# Altium schematic sheet STALO_2.SchDoc: STALO_2 (part 2 of 2)
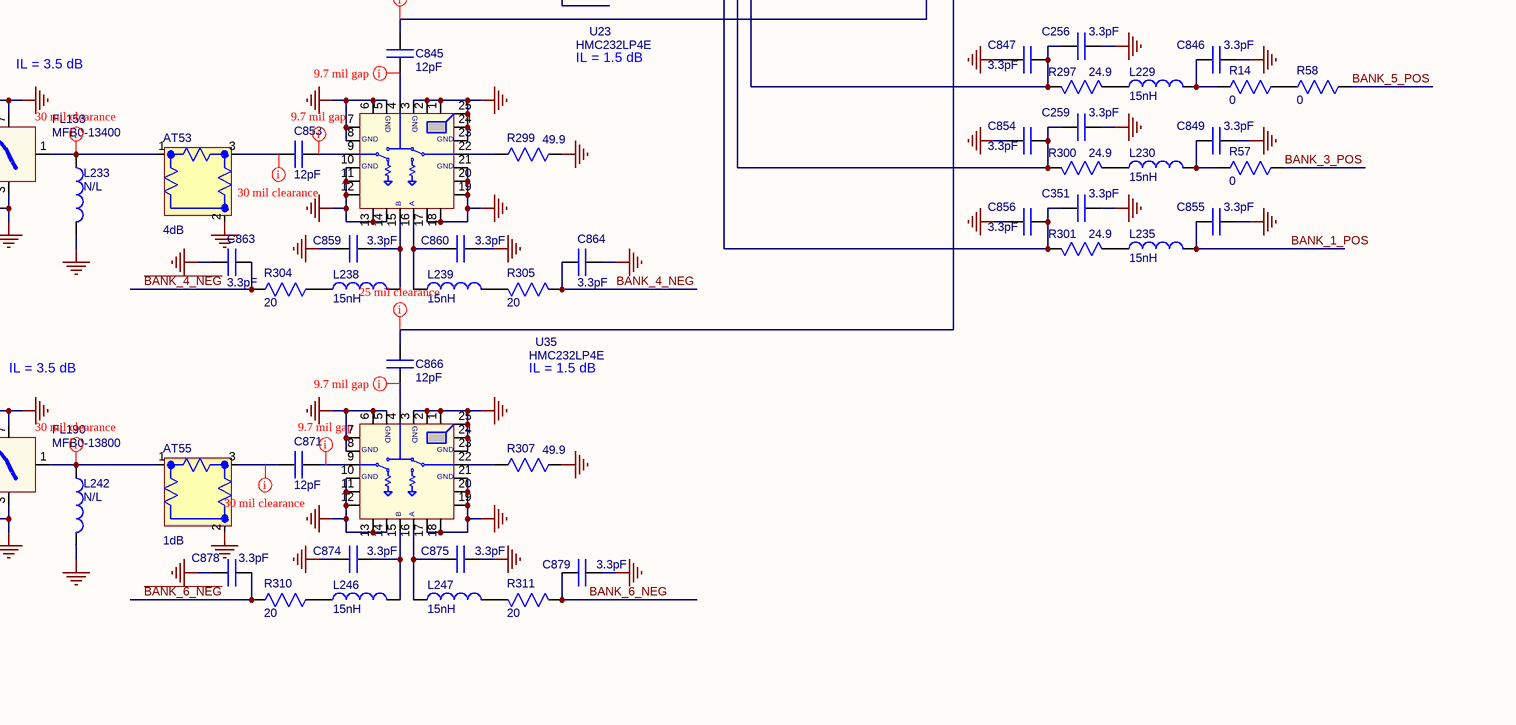
[diagram p4: STALO_2.SchDoc, bottom right]

## Library data of the parts
AT2 AT5 AT9 AT11 AT15 AT54 AT59 AT62 = MPFC-A1002: NoLoad: .; Approved: CL; M_PN: IMS1141-02DB; MFGR: IMS RESISTORS; level: 1; line_number: 10; ModifyDate: 3/8/13; G_PN: MPFC-A1002; item_number: MPFC-A1002
AT4 AT7 AT8 AT13 AT53 AT57 = MPFC-A1004: NoLoad: .; Approved: CL; M_PN: IMS1141-04DB; MFGR: IMS RESISTORS; level: 1; line_number: 30; ModifyDate: 3/8/13; G_PN: MPFC-A1004; item_number: MPFC-A1004
AT55 = MPFC-A1001: NoLoad: .; Approved: CL; M_PN: IMS1141-01DB; MFGR: IMS RESISTORS; level: 1; line_number: 15; ModifyDate: 3/8/13; G_PN: MPFC-A1001; item_number: MPFC-A1001
AT61 = MPFC-A1000: NoLoad: .; Approved: CL; M_PN: IMS1141-00DB; MFGR: IMS RESISTORS; level: 1; line_number: 50; ModifyDate: 4/16/13; G_PN: MPFC-A1000; item_number: MPFC-A1000
C18 C20 C25 C29 C111 C113 C114 C116 C188 C200 C201 C203 C401 C722 C822 C828 C829 C831 C845 C850 C851 C853 C866 C868 C869 C871 C881 = CK40-00120: Approved: CL; NoLoad: .; MFGR: ANY; level: 1; line_number: 165; G_PN: CK40-00120; ModifyDate: 10/06/12; M_PN: ANY; item_number: CK40-00120
C102-C105 C108 C109 C117 C118 C148-C152 C175-C179 C182-C186 C191-C193 C195-C199 C232-C234 C241 C253-C256 C259 C351-C357 C365-C367 C399 C400 C826 C827 C832-C839 C842 C843 C846 C847 C849 C854-C864 C872-C879 = CK35-00033: MFGR: VENKEL; M_PN: C0201C0G500-3R3BNP; Approved: CL; NoLoad: .; level: 1; line_number: 155; ModifyDate: 6/24/13; G_PN: CK35-00033; item_number: CK35-00033
C106 C107 C115 C180 C181 C840 C841 C886 C891 C893 C953-C955 C965-C967 = CK41-00024: MFGR: ATC; M_PN: 600L2R4AT200; Approved: CL; NoLoad: .; level: 1; line_number: 60; ModifyDate: 02/09/13; G_PN: CK41-00024; item_number: CK41-00024
C189 C190 C823 C825 C892 = CK40-04100: Approved: CL; MFGR: VENKEL; M_PN: C0402X7R160-104KNP; NoLoad: .; level: 1; line_number: 95; ModifyDate: 3/29/13; G_PN: CK40-04100; item_number: CK40-04100
C361 C961 C1224 = CK45-04100: Approved: CL; NoLoad: .; MFGR: ANY; level: 1; line_number: 105; ModifyDate: 02/22/12; G_PN: CK45-04100; M_PN: ANY; item_number: CK45-04100
C402 C956-C958 C968 = TCC3-03100: Approved: CL; NoLoad: .; MFGR: ATC; M_PN: ATC520L103KT16T; level: 1; line_number: 90; G_PN: TCC3-03100; ModifyDate: 4/26/13; item_number: TCC3-03100
C727 C730 C952 C962-C964 = CK40-00120: MFGR: ANY; Approved: CL; NoLoad: .; level: 1; line_number: 165; ModifyDate: 10/06/12; M_PN: ANY; G_PN: CK40-00120; item_number: CK40-00120
C880 C883 C885 = CK40-00330: Approved: CL; MFGR: ANY; NoLoad: .; level: 1; line_number: 295; ModifyDate: 3/9/13; G_PN: CK40-00330; M_PN: ANY; item_number: CK40-00330
C882 = CK41-00018: Approved: CL; NoLoad: .; M_PN: 600L1R8AT200; MFGR: ATC; level: 1; line_number: 175; G_PN: CK41-00018; ModifyDate: 02/09/13; item_number: CK41-00018
C884 = CK41-00007: Approved: CL; NoLoad: .; M_PN: 600L0R7AT200; MFGR: ATC; level: 1; line_number: 300; G_PN: CK41-00007; ModifyDate: 4/9/13; item_number: CK41-00007
C887-C890 = CK40-01100: MFGR: Any; Approved: CL; NoLoad: .; level: 1; line_number: 70; ModifyDate: 3/21/12; M_PN: Any; G_PN: CK40-01100; item_number: CK40-01100
C959 = CK40-00120: Approved: CL; MFGR: ANY; level: 1; line_number: 165; G_PN: CK40-00120; ModifyDate: 10/06/12; M_PN: ANY; item_number: CK40-00120
C969 C970 C1225-C1229 = CK40-01470: Approved: CL; MFGR: Any; NoLoad: .; level: 1; line_number: 75; ModifyDate: 02/22/12; G_PN: CK40-01470; M_PN: Any; item_number: CK40-01470
FL11 FL22 FL23 FL45 FL49 FL50 = LFS0-00222: Approved: CL; NoLoad: .; M_PN: NFE31PT222Z1E9BL; MFGR: MURATA; level: 1; line_number: 335; G_PN: LFS0-00222; ModifyDate: 02/22/12; Value: 2200pF; item_number: LFS0-00222
FL27 FL28 = MFB0-13600: Approved: CL; NoLoad: .; Value: 940685; MFGR: IMC; level: 1; line_number: 385; ModifyDate: 5/30/13; M_PN: 940685; G_PN: MFB0-13600; item_number: MFB0-13600
FL29 FL33 = MFB0-13200: Approved: CL; MFGR: IMC; NoLoad: .; Value: 940683; level: 1; line_number: 410; ModifyDate: 5/30/13; M_PN: 940683; G_PN: MFB0-13200; item_number: MFB0-13200
FL34 FL37 = MFB0-12800: Approved: CL; MFGR: IMC; NoLoad: .; Value: 940681; level: 1; line_number: 430; ModifyDate: 5/30/13; M_PN: 940681; G_PN: MFB0-12800; item_number: MFB0-12800
FL39 FL48 = MFL0-03900: NoLoad: .; MFGR: Mini-Circuits; Approved: NM; level: 1; line_number: 440; ModifyDate: 11/17/12; M_PN: LFCN-3800; G_PN: MFL0-03900; item_number: MFL0-03900
FL43 FL151 = MFB0-13000: Approved: CL; MFGR: IMC; NoLoad: .; Value: 940682; level: 1; line_number: 455; ModifyDate: 5/30/13; M_PN: 940682; G_PN: MFB0-13000; item_number: MFB0-13000
FL47 FL51 = LFS0-00250: Approved: NM; NoLoad: .; M_PN: NFL18ST207X1C3; MFGR: MURATA; level: 1; line_number: 415; ModifyDate: 02/22/12; Value: 25pF; G_PN: LFS0-00250; item_number: LFS0-00250
FL152 FL153 = MFB0-13400: Approved: CL; MFGR: IMC; NoLoad: .; Value: 940684; level: 1; line_number: 345; ModifyDate: 5/30/13; M_PN: 940684; G_PN: MFB0-13400; item_number: MFB0-13400
FL173 FL190 = MFB0-13800: Approved: CL; NoLoad: .; Value: 940686; MFGR: IMC; level: 1; line_number: 355; ModifyDate: 5/30/13; M_PN: 940686; G_PN: MFB0-13800; item_number: MFB0-13800
FL500 FL501 FL506 = LFS0-00222: Filter EMI 2200PF,1206; Approved: CL; NoLoad: .; M_PN: NFE31PT222Z1E9BL; MFGR: MURATA; level: 1; line_number: 335; G_PN: LFS0-00222; ModifyDate: 02/22/12; Value: 2200pF; item_number: LFS0-00222
FT7 FT18 FT33 = FromToNode: level: 1; Approved: *; G_PN: *; MFGR: *; Value: *
J2 = JRSM-70101: SMPM FD MALE,STRAIGHT SMT, R/A COPLANAR, 4 PIN THRU-HOLE; Value: B012-P93-02; MFGR: GILBERT; Approved: CL; level: 1; line_number: 480; M_PN: B012-P93-02; NoLoad: .; ModifyDate: 10/15/14; G_PN: JRSM-70101; item_number: JRSM-70101
J25 = JRSM-40101: Value: 3287-6101; MFGR: SV MICROWAVE; Approved: CL; level: 1; M_PN: 3287-6101; ModifyDate: 4/10/13; G_PN: JRSM-40101; item_number: JRSM-40101
L5 L89 = 13000220-400: M_PN: 0402CS-40NXGLU; MFGR: COILCRAFT; NoLoad: .; Approved: CL; level: 1; line_number: 600; G_PN: 13000220-400; ModifyDate: 7/2/13; item_number: 13000220-400
L8-L11 L17 L18 L54 L55 L78 L79 L84 L85 L153-L155 L157 L231-L234 L240-L243 = LSA6-02390: MFGR: COILCRAFT; Approved: CL; M_PN: 0402HP-3N9XGLU; level: 1; line_number: 620; ModifyDate: 3/13/13; Value: 3.9nH; G_PN: LSA6-02390; item_number: LSA6-02390
L12 L13 L15 L16 L19 L20 L56 L57 L59 L65-L69 L71 L73 L76 L77 L88 L90 L149-L152 L156 L158-L162 L206 L229 L230 L235-L239 L244-L250 = LSA6-03150: MFGR: COILCRAFT; NoLoad: .; Approved: CL; M_PN: 0402HP-15NXGLU; level: 1; line_number: 515; ModifyDate: 3/8/13; G_PN: LSA6-03150; item_number: LSA6-03150
L504 = LSA3-04390: M_PN: 0603CS-R39XJLU; NoLoad: .; Approved: CL; MFGR: COILCRAFT; level: 1; line_number: 580; G_PN: LSA3-04390; ModifyDate: 02/22/12; item_number: LSA3-04390
R2 R316 = RK40-00113: NoLoad: .; MFGR: ANY; Approved: CL; level: 1; line_number: 730; G_PN: RK40-00113; ModifyDate: 7/2/13; M_PN: ANY; item_number: RK40-00113
R6 R7 R69 R74 R99 R100 R118 R275 R298 R299 R306 R307 = RK35-00499: Approved: CL; NoLoad: .; MFGR: ANY; level: 1; line_number: 650; ModifyDate: 02/22/12; G_PN: RK35-00499; M_PN: ANY; item_number: RK35-00499
R10 R64 R76 R77 R80 R83 R87 R95-R97 R102 R112 R115 R291-R294 R297 R300-R303 R308 R309 = RK35-00249: NoLoad: .; Approved: CL; MFGR: ANY; level: 1; line_number: 655; G_PN: RK35-00249; ModifyDate: 02/22/12; M_PN: ANY; item_number: RK35-00249
R11 R14 R53 R54 R57 R58 = RK40-00000: NoLoad: .; MFGR: ANY; Approved: CL; level: 1; line_number: 710; ModifyDate: 3/27/13; M_PN: ANY; G_PN: RK40-00000; item_number: RK40-00000
R65 R66 R88 R91 R113 R114 R295 R296 R304 R305 R310 R311 = RK30-00200: NoLoad: .; Approved: CL; MFGR: Vishay-Dale; M_PN: CRCW020120R0FNED; level: 1; line_number: 782; G_PN: RK30-00200; ModifyDate: 7/24/13; item_number: RK30-00200
R671 = RK65-00392: NoLoad: .; MFGR: VISHAY/DALE; Approved: CL; M_PN: CRCW201039R2FKEF; level: 1; line_number: 892; ModifyDate: 10/14/14; G_PN: RK65-00392; item_number: RK65-00392
R672 = RK65-01107: NoLoad: .; MFGR: VISHAY/DALE; Approved: CL; M_PN: CRCW2010107RFKEF; level: 1; line_number: 715; ModifyDate: 4/23/13; G_PN: RK65-01107; item_number: RK65-01107
R781 R782 = RK65-00499: NoLoad: .; MFGR: ROHM; Approved: CL; M_PN: MCR50JZHF49R9; level: 1; line_number: 1035; ModifyDate: 4/26/12; G_PN: RK65-00499; item_number: RK65-00499
U4 U7-U10 U13 U18 U20 U22 U23 U25 U35 = MRSS-12012: MFGR: HITTITE; Approved: CL; Value: HMC232LP4E; NoLoad: .; level: 1; line_number: 1210; ModifyDate: 4/8/13; G_PN: MRSS-12012; item_number: MRSS-12012
U15 U17 = MRSS-16004: MFGR: HITTITE; Approved: CL; Value: MASWCC0006; NoLoad: .; level: 1; line_number: 1135; ModifyDate: 4/8/13; G_PN: MRSS-16004; item_number: MRSS-16004
U31 U33 = MA20-00006: M_PN: SKY65017-70LF; Approved: CL; MFGR: SKYWORKS; NoLoad: .; Value: SKY65017-70LF; level: 1; line_number: 1160; G_PN: MA20-00006; ModifyDate: 6/26/14; item_number: MA20-00006
U82 = MMDC-00204: Value: LT5579IUH#PBF; NoLoad: .; Approved: CL; MFGR: LINEAR TECH; level: 1; line_number: 1315; ModifyDate: 2/26/13; G_PN: MMDC-00204; item_number: MMDC-00204
U169 = MA12-10001: M_PN: MAV-11BSM+; NoLoad: .; Approved: CL; MFGR: MINI-CIRCUITS; Value: MAV-11BSM+; level: 1; line_number: 1155; ModifyDate: 5/24/13; G_PN: MA12-10001; item_number: MA12-10001
X5 = LTR4-S0104: M_PN: MABAES0061; NoLoad: .; MFGR: MACOM TECH; Approved: CL; Value: MABAES0061; level: 1; line_number: 1085; ModifyDate: 6/1/13; G_PN: LTR4-S0104; item_number: LTR4-S0104